# EAGLE schematic node_v1 (EAGLE 9.6.2)
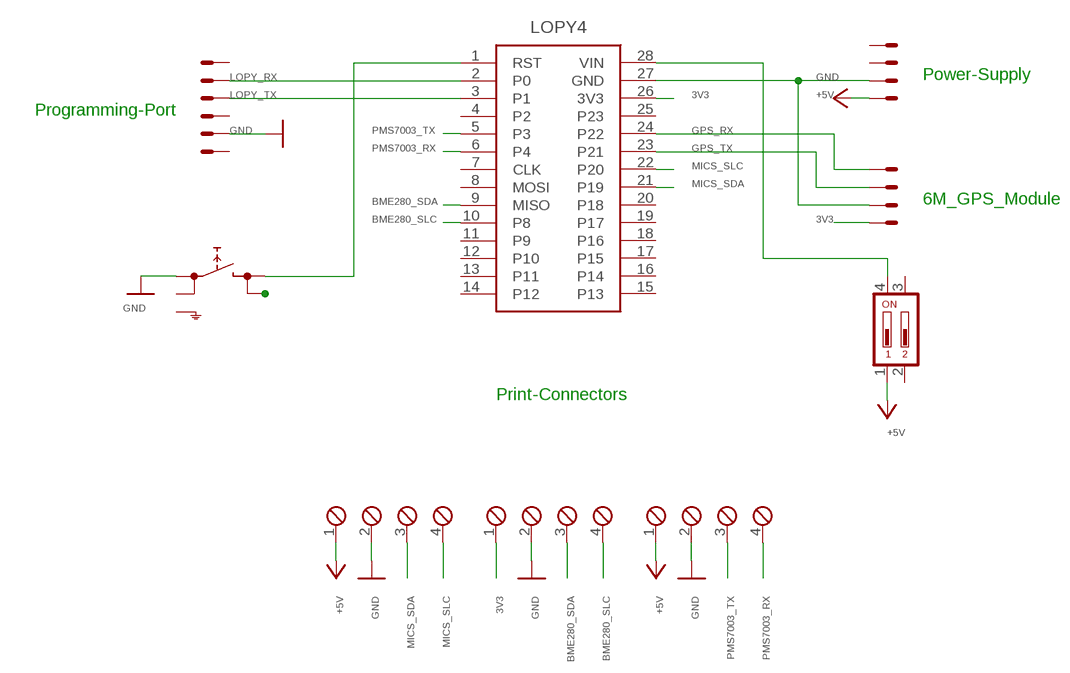
[diagram p0: schematic, sheet 1]

## Parts
5V  MPT4  [4POL254]
GND  22-23-2041  [22-23-2041]
IC1  LOPY4  [LOPY4]
S1  DA02  [DA-02]
S2  SKHMPSE010  [SKHMPXE010]
X1  22-23-2061  [22-23-2061]
X2  MPT4  [4POL254]
X3  MPT4  [4POL254]
X4  22-23-2041  [22-23-2041]

## Nets
3V3: IC1.26(3V3) X2.1 X4.4
+5V: 5V.1 GND.4 S1.1 X3.1
BME280_SDA: IC1.9(MISO) X2.3
BME280_SLC: IC1.10(P8) X2.4
GND: 5V.2 GND.3 IC1.27(GND) S2.1(1.1) X1.2 X2.2 X3.2 X4.3
GPS_RX: IC1.24(P22) X4.1
GPS_TX: IC1.23(P21) X4.2
LOPY_RX: IC1.2(P0) X1.5
LOPY_TX: IC1.3(P1) X1.4
MICS_SDA: 5V.3 IC1.21(P19)
MICS_SLC: 5V.4 IC1.22(P20)
N$1: IC1.1(RST) S2.3(2.1)
N$2: IC1.28(VIN) S1.4
N$3: S2.4(2.2)
PMS7003_RX: IC1.6(P4) X3.4
PMS7003_TX: IC1.5(P3) X3.3
Unconnected: GND.1 GND.2 IC1.4(P2) IC1.7(CLK) IC1.8(MOSI) IC1.11(P9) IC1.12(P10) IC1.13(P11) IC1.14(P12) IC1.15(P13) IC1.16(P14) IC1.17(P15) IC1.18(P16) IC1.19(P17) IC1.20(P18) IC1.25(P23) S1.2 S1.3 S2.2(1.2) S2.5(SH) X1.1 X1.3 X1.6

## Notes on the sheet
- Power-Supply
- Programming-Port
- 6M_GPS_Module
- Print-Connectors

## Library data of the parts
5V X2 X3 = con-phoenix-254:MPT4: PHOENIX CONNECTOR; OC_FARNELL: unknown; OC_NEWARK: unknown
GND X4 = con-molex:22-23-2041: .100" (2.54mm) Center Header - 4 Pin; MF: MOLEX; MPN: 22-23-2041; OC_FARNELL: 1462920; OC_NEWARK: 38C0355
IC1 = LOPY4:LOPY4: Pycom Pycom LoPy4 Bluetooth Smart (BLE), LoRa, SigFox, WiFi Development Board Source: Datasheet <https://pycom.io/wp-content/uploads/2018/03/Pycom_Specsheet_LoPy4.pdf>; ARROW_PART_NUMBER: LOPY4; ARROW_PRICE-STOCK: https://www.arrow.com/en/products/lopy4/pycom-ltd; DESCRIPTION: Pycom Pycom LoPy4 Bluetooth Smart (BLE), LoRa, SigFox, WiFi Development Board; HEIGHT: 5mm; MANUFACTURER_NAME: Pycom; MANUFACTURER_PART_NUMBER: LOPY4; MOUSER_PART_NUMBER: 365-LOPY4; MOUSER_PRICE-STOCK: https://www.mouser.com/Search/Refine.aspx?Keyword=365-LOPY4
S1 = switch-dil:DA02: DIL/CODE SWITCH; OC_FARNELL: 1255229; OC_NEWARK: unknown
S2 = switch:SKHMP*E010: 6.2 X 6.5mm TACT Switch (SMD) Source: http://www3.alps.co.jp/WebObjects/catalog.woa/PDF/E/Switch/Tact/SKHM/SKHM.PDF
X1 = con-molex:22-23-2061: .100" (2.54mm) Center Header - 6 Pin; MF: MOLEX; MPN: 22-23-2061; OC_FARNELL: 1462922; OC_NEWARK: 27C1933